# Altium schematic sheet white_noise.SchDoc
size A4
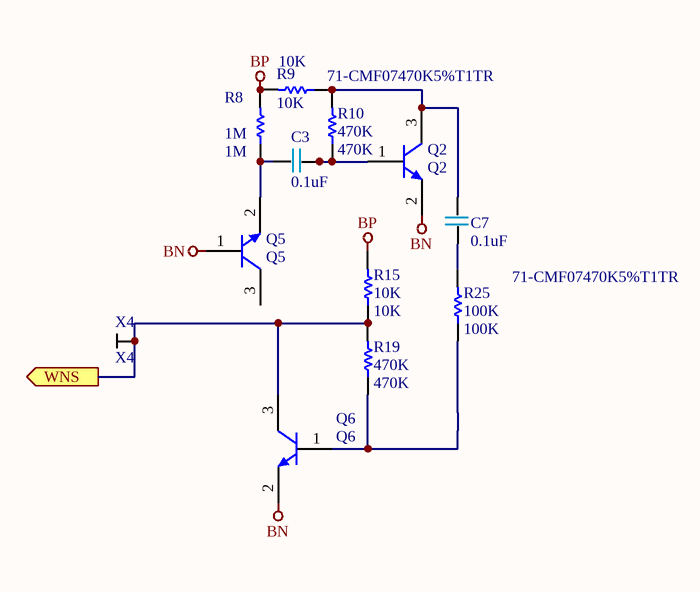
[diagram p0: white_noise.SchDoc]

## Parts
C3  0.1uF  [Cap Film 5]
C7  0.1uF  [Cap Film 5]
Q2  Q2  [ONSC-SC-75-3-463-01_V]
Q5  Q5  [ONSC-SC-75-3-463-01_V]
Q6  Q6  [ONSC-SC-75-3-463-01_V]
R8  1M  [AXIAL-0.3]
R9  10K  [AXIAL-0.3]
R10  470K  Supplier Part Number 1: 71-CMF07470K5%T1TR  [AXIAL-0.3]
R15  10K  [AXIAL-0.3]
R19  470K  Supplier Part Number 1: 71-CMF07470K5%T1TR  [AXIAL-0.3]
R25  100K  [AXIAL-0.3]
X4  X4  [Pad]

## Ports
WNS (out)

## Nets
BN: Q2.2(E) Q5.1(B) Q6.2(E)
BP: R8.2 R9.2 R15.2
WNS: Q6.3(C) R15.1 R19.2 X4.1 ; port WNS
NetC3_1: C3.1 Q5.2(E) R8.1
NetC3_2: C3.2 Q2.1(B) R10.1
NetC7_1: C7.1 R25.2
NetC7_2: C7.2 Q2.3(C) R9.1 R10.2
NetQ6_1: Q6.1(B) R19.1 R25.1

Not connected (* = marked no-connect by the designer): Q5 3(C)

## Library data of the parts
C3 C7 = Cap Film 5: Value: 0.1uF; Supplier 1: Mouser; Supplier Part Number 1: 594-K104K20X7RH53K2
Q2 Q5 Q6 = MMBT3904TT1G: General Purpose Transistor, NPN Silicon, 3-Pin SC-75, Pb-Free, Tape and Reel; Manufacturer: On Semiconductor; fT Min (MHz): 300; IC Continuous (A): 0.2; DatasheetVersion: Rev. 5; PackageVersion: Rev. F, 07/2005; PackageReference: SC-75-3-463-01; PackageDescription: 3-Pin Small Outline Transistor, Body 1.6 x 0.8 mm, Pitch 0.5 mm; Supplier 1: Mouser; Supplier Part Number 1: 863-MMBT3904TT1G; Supplier 2: Digi-Key; Supplier Part Number 2: MMBT3904TT1GOSCT-ND; Supplier 3: Digi-Key; Supplier Part Number 3: MMBT3904TT1GOSDKR-ND; Supplier 4: Farnell; Supplier Part Number 4: 2317833; Supplier 5: Newark; Supplier Part Number 5: 88H4787; Supplier 6: Newark; Supplier Part Number 6: 85W3166; Supplier 7: Mouser; Supplier Part Number 7: 863-MMBT3904TT1G; Packing: Tape and Reel; Polarity: NPN; RoHS: TRUE; Mounting Technology: Surface Mount; PartNumber: MMBT3904TT1G; ComponentLink1Description: Manufacturer URL; ComponentLink1URL: http://www.onsemi.com/; ComponentLink2Description: Datasheet; ComponentLink2URL: http://www.onsemi.cn/pub_link/Collateral/MMBT3904TT1-D.PDF; ComponentLink3Description: Package Specification; ComponentLink3URL: http://www.onsemi.com/pub_link/Collateral/463-01.PDF
R8 = Res1: Resistor; Manufacturer Part Number: CMF551M0000FKEB; Brand: Vishay / Dale; Lead Diameter: 0.64 mm; Power Rating: 500 mW (1/2 W); Resistance: 1 MOhms; Temperature Coefficient: 100 PPM / C; Tolerance: 1 %; Voltage Rating: 250 V; Published: 8-Jun-2000; LatestRevisionDate: 17-Jul-2002; LatestRevisionNote: Re-released for DXP Platform.; PackageReference: AXIAL-0.3; Publisher: Altium Limited; PackageDescription: Axial Device, Thru-Hole; 2 Leads; 0.3 in Pin Spacing; Value: 1M; Category: Metal Film Resistors - Through Hole; ComponentLink1Description: http://www.mouser.com/ds/2/427/cmfind-239942.pdf; ComponentLink1URL: http://www.mouser.com/ds/2/427/cmfind-239942.pdf; Diameter: 2.29 mm; Length: 6.1 mm; Manufacturer: Vishay / Dale; Minimum Order Quantity: 1; Operating Temperature Range: - 55 C to + 175 C; Packaging: Reel; Pricing 1: 1=0.310, 50=0.232, 100=0.146, 500=0.125, 1000=0.087, 2000=0.081, 5000=0.073, 10000=0.072, 25000=0.069 (USD); Product: Metal Film Resistors Controlled Temp Coefficient; Reeling: True; RoHS - Mouser: Y; RoHS: RoHS Compliant; Series: CMF Industrial; Standard Pack Qty: 1000; Stock 1: 2620; Supplier 1: Mouser; Supplier Part Number 1: 71-CMF551M0000FKEB; Termination Style: Axial; Type: Metal Film Resistors, Industrial, Precision
R9 R15 = Res1: Resistor; Manufacturer Part Number: CCF0710K0JKE36; Published: 8-Jun-2000; LatestRevisionDate: 17-Jul-2002; LatestRevisionNote: Re-released for DXP Platform.; PackageReference: AXIAL-0.3; Publisher: Altium Limited; PackageDescription: Axial Device, Thru-Hole; 2 Leads; 0.3 in Pin Spacing; Value: 10K; Supplier Part Number 1: 71-CMF5510K000BEEA; Supplier 1: Mouser; Supplier Part Number 2: 71-CMF5510K000BEEA
R10 R19 = Res1: Resistor; Manufacturer: Vishay / Dale; Manufacturer Part Number: CMF07470K00JKR6; Power Rating: 500 mW (1/2 W); Resistance: 470 kOhms; Temperature Coefficient: 100 PPM / C; Tolerance: 5 %; Voltage Rating: 250 V; Lead Diameter: 0.64 mm; Published: 8-Jun-2000; LatestRevisionDate: 17-Jul-2002; LatestRevisionNote: Re-released for DXP Platform.; PackageReference: AXIAL-0.3; Publisher: Altium Limited; PackageDescription: Axial Device, Thru-Hole; 2 Leads; 0.3 in Pin Spacing; Value: 470K; Supplier 1: Mouser; RoHS: No; Category: Metal Film Resistors - Through Hole; Stock 1: 1018; Pricing 1: 1=0.160, 1000=0.160, 2000=0.085, 4000=0.078, 10000=0.072, 20000=0.066 (USD); Diameter: 2.29 mm; Length: 6.1 mm; Operating Temperature Range: - 55 C to + 175 C; Packaging: Reel; Product: Metal Film Resistors Controlled Temp Coefficient; Series: CMF Industrial; Termination Style: Axial; Type: Metal Film Resistors, Industrial, Precision; Brand: Vishay / Dale; Standard Pack Qty: 1000; RoHS - Mouser: N; Minimum Order Quantity: 1; Reeling: True; ComponentLink1URL: http://www.mouser.com/ds/2/427/cmfind-239942.pdf; ComponentLink1Description: http://www.mouser.com/ds/2/427/cmfind-239942.pdf
R25 = Res1: Resistor; Manufacturer Part Number: CMF55100K00FHEK; Brand: Vishay / Dale; Lead Diameter: 0.64 mm; Power Rating: 500 mW (1/2 W); Resistance: 100 kOhms; Temperature Coefficient: 50 PPM / C; Tolerance: 1 %; Voltage Rating: 250 V; Published: 8-Jun-2000; LatestRevisionDate: 17-Jul-2002; LatestRevisionNote: Re-released for DXP Platform.; PackageReference: AXIAL-0.3; Publisher: Altium Limited; PackageDescription: Axial Device, Thru-Hole; 2 Leads; 0.3 in Pin Spacing; Value: 100K; Category: Metal Film Resistors - Through Hole; ComponentLink1Description: http://www.mouser.com/ds/2/427/cmfind-239942.pdf; ComponentLink1URL: http://www.mouser.com/ds/2/427/cmfind-239942.pdf; Diameter: 2.29 mm; Length: 6.1 mm; Manufacturer: Vishay / Dale; Minimum Order Quantity: 1; Operating Temperature Range: - 55 C to + 175 C; Packaging: Bulk; Pricing 1: 1=0.230, 25=0.181, 100=0.132, 500=0.115, 1000=0.099, 2000=0.092, 5000=0.087, 10000=0.082, 25000=0.072 (USD); Product: Metal Film Resistors Controlled Temp Coefficient; Reeling: False; RoHS - Mouser: Y; RoHS: RoHS Compliant; Series: CMF Industrial; Standard Pack Qty: 100; Stock 1: 4041; Supplier 1: Mouser; Supplier Part Number 1: 71-CMF55100K00FHEK; Termination Style: Axial; Type: Metal Film Resistors, Industrial, Precision; Supplier Part Number 2: 71-CMF55100K00BEEB
X4 = Pad